# Altium schematic sheet MAZ000161 - Diagrama físico.SchDoc: MAZ000161 - Diagrama físico
size A; ApprovedBy: Christian Ledwidth; CheckedBy: Nahuel Martinez; Author: Santiago Marti; CompanyName: Body Health; DrawnBy: Santiago Marti; Revision: A; SheetNumber: 2; SheetTotal: 2
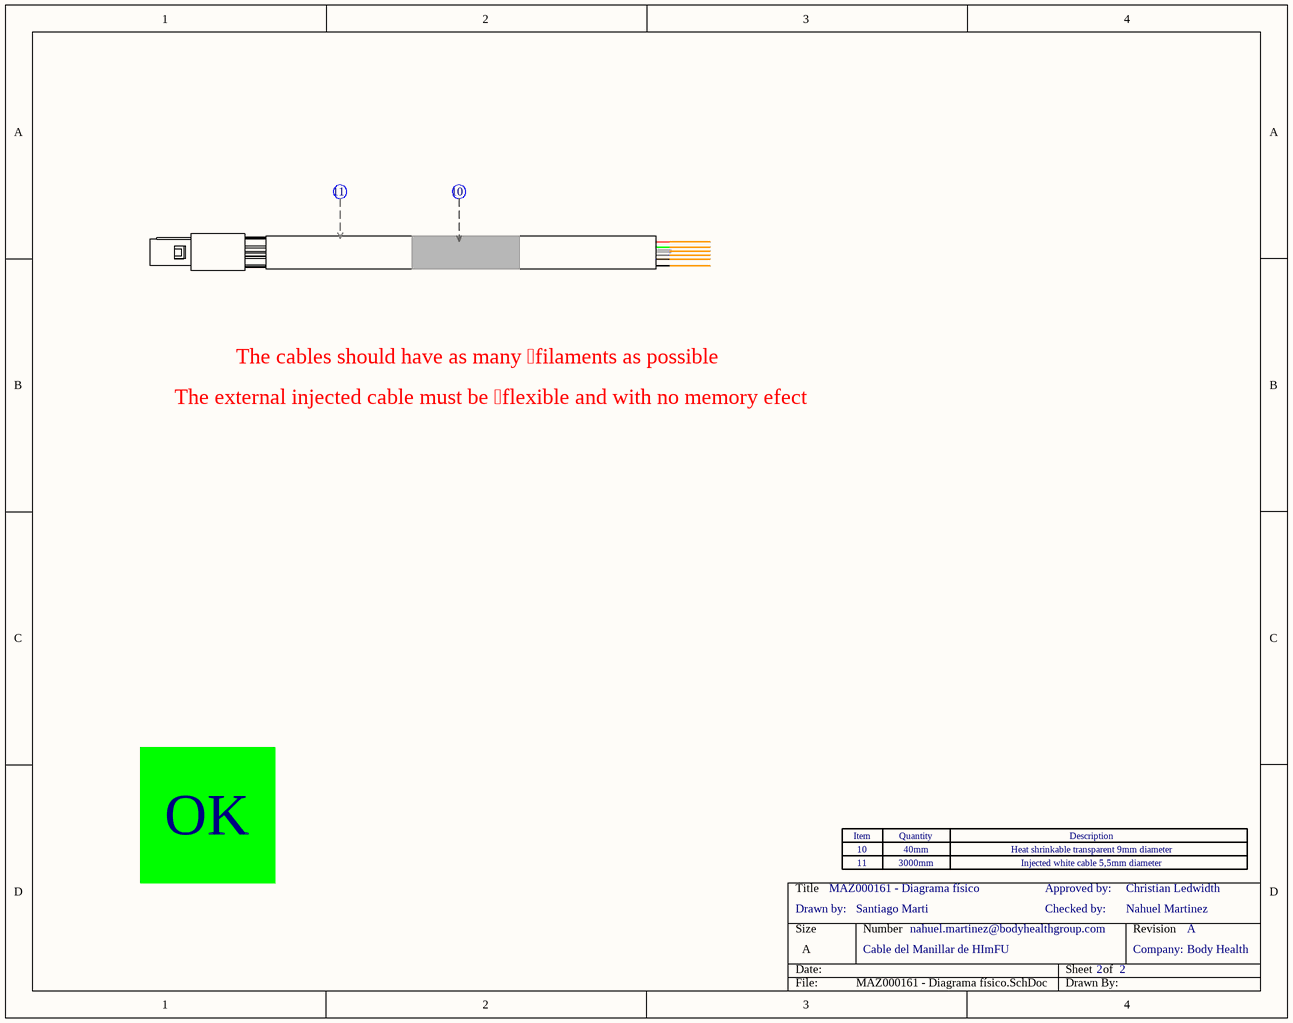
[diagram p0: MAZ000161 - Diagrama físico.SchDoc]

## Parts
(Parts that share a designator on the sheet are numbered #1, #2 ... from top to bottom, then left to right.)
Cab1  Cable  (value not drawn)
Cab?  Cable  (value not drawn)
Conn1  SZCNT_08_Macho  (value not drawn)  (part A of 3)
Zoc?#1  Zócalo_Header  (value not drawn)
Zoc?#2  Zócalo_Item  (value not drawn)
Zoc?#3  Zócalo_Item  (value not drawn)

## Notes on the sheet
- The cables should have as many filaments as possible
- The external injected cable must be flexible and with no memory efect
- OK
- (near Zoc?#3) Drawn by:
- (near Zoc?#1) 10
- (near Zoc?#2) 11
- 40mm
- 3000mm
- Checked by:
- Approved by:
- Heat shrinkable transparent 9mm diameter
- Injected white cable 5,5mm diameter
- Cable del Manillar de HImFU
- nahuel.martinez@bodyhealthgroup.com
- Company:
- (in symbol Zócalo_Header) Item; Quantity; Description

## Library data of the parts
Cab1 = Cable: CallOut: 11; Largo: *mm; Sección: *mm2; Color: *
Cab? = Cable: CallOut: 10; Largo: *mm; Sección: *mm2; Color: *
Conn1 = SZCNT_08_Macho: Conector SZCNT 8 vías macho para cable; Cod.DigiKey: Se compra a SZCNT; Cod.Fabricante: *; ComponentLink1Description: Manufacturer Link; ComponentLink1URL: *; DIGIKEYx100: *; Fabricante: SZCNT; CallOut: *; DIGIKEYx50: *
Zoc?#1 = Zócalo_Header: Header para el zócalo de referencias
Zoc?#2 Zoc?#3 = Zócalo_Item: Ítem para el zócalo de referencias; Desginator: *; Quantity: *; ItemDescription: *